# Altium schematic sheet PX4FLOW2.0_CPU_X0.SchDoc
size A4; DrawnBy: Philip Rowse
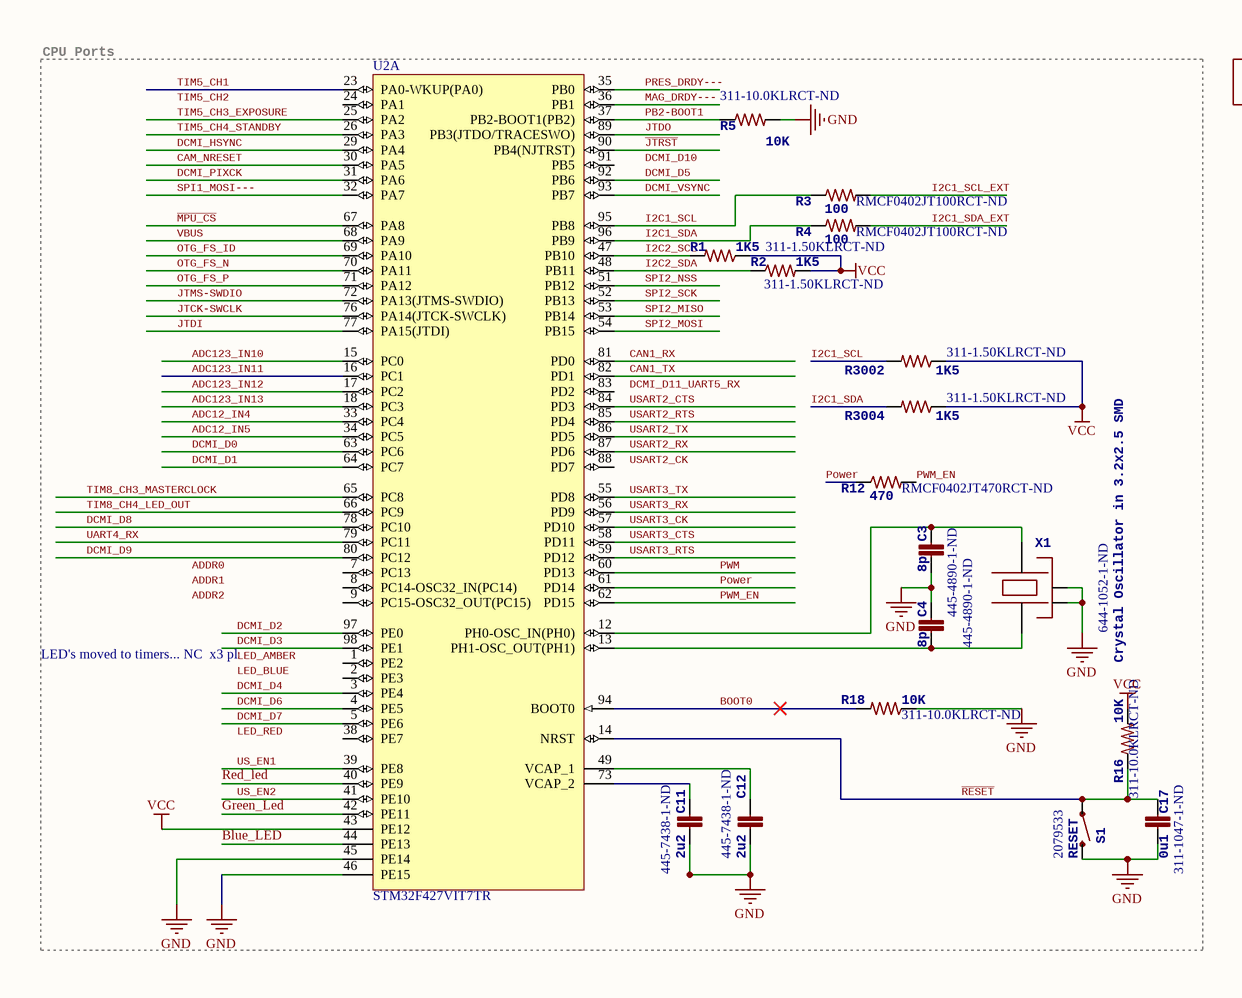
[diagram p0: PX4FLOW2.0_CPU_X0.SchDoc, left]
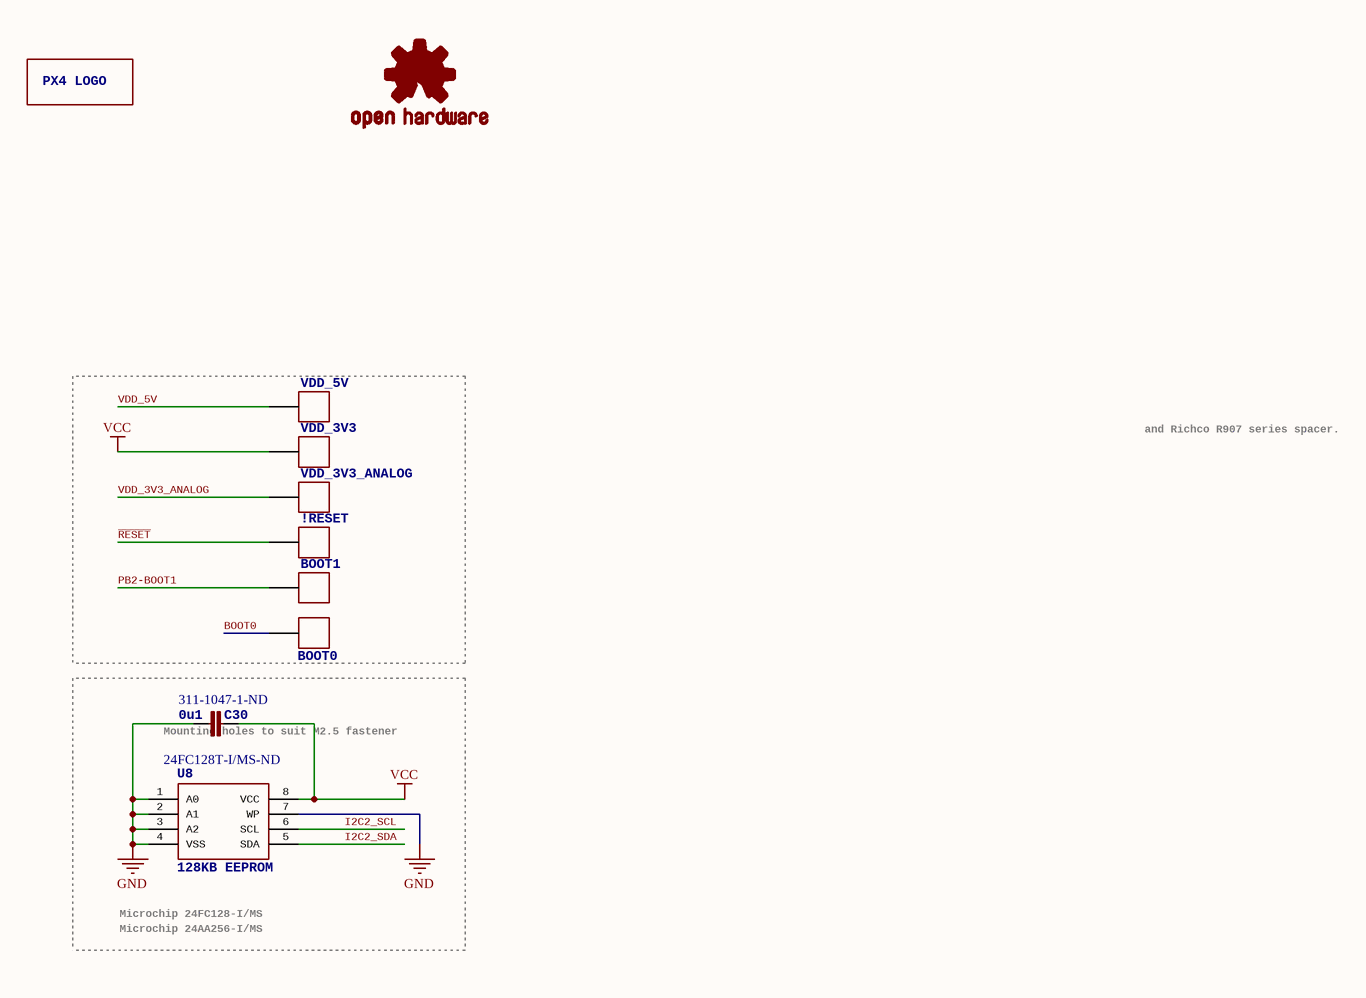
[diagram p1: PX4FLOW2.0_CPU_X0.SchDoc, right]

## Parts
!RESET  PAD.04  [PAD.04X.04]  (value not drawn)
BOOT0  PAD.05  [PAD.05X.05]  (value not drawn)
BOOT1  PAD.04  [PAD.04X.04]  (value not drawn)
C3  8p  Supplier Part Number 1: 445-4890-1-ND  [0402-CAP]
C4  8p  Supplier Part Number 1: 445-4890-1-ND  [0402-CAP]
C11  2u2  Supplier Part Number 1: 445-7438-1-ND  [0603-CAP]
C12  2u2  Supplier Part Number 1: 445-7438-1-ND  [0603-CAP]
C17  0u1  Supplier Part Number 1: 311-1047-1-ND  [0402-CAP]
C30  0u1  Supplier Part Number 1: 311-1047-1-ND  [0402-CAP]
R1  1K5  Supplier Part Number 1: 311-1.50KLRCT-ND  [R0402]
R2  1K5  Supplier Part Number 1: 311-1.50KLRCT-ND  [R0402]
R3  100  Supplier Part Number 1: RMCF0402JT100RCT-ND  [R0402]
R4  100  Supplier Part Number 1: RMCF0402JT100RCT-ND  [R0402]
R5  10K  Supplier Part Number 1: 311-10.0KLRCT-ND  [R0402]
R12  470  Supplier Part Number 1: RMCF0402JT470RCT-ND  [R0402]
R16  10K  Supplier Part Number 1: 311-10.0KLRCT-ND  [R0402]
R18  10K  Supplier Part Number 1: 311-10.0KLRCT-ND  [R0402]
R3002  1K5  Supplier Part Number 1: 311-1.50KLRCT-ND  [R0402]
R3004  1K5  Supplier Part Number 1: 311-1.50KLRCT-ND  [R0402]
S1  RESET  Supplier Part Number 1: 2079533  [EVQP7J01K]
U2  STM32F427VIT7TR  [STM-LQFP100_N]  (part A of 2)
U8  128KB EEPROM  Supplier Part Number 1: 24FC128T-I/MS-ND  [MSOP-8]
U$9  PX4LOGO: PX4 LOGO  [PX4-LOGO-20MM]  (hidden comment: PX4-LOGO-20MM)
U$10  OSHW-LOGOS  [OSHW-LOGO-S]  (value not drawn)
VDD_3V3  PAD.04  [PAD.04X.04]  (value not drawn)
VDD_3V3_ANALOG  PAD.04  [PAD.04X.04]  (value not drawn)
VDD_5V  PAD.04  [PAD.04X.04]  (value not drawn)
X1  Crystal Oscillator in 3.2x2.5 SMD  Supplier Part Number 1: 644-1052-1-ND  [OSCILLATOR-3.2X2.5]

## Nets
GND: C3.P$2 C4.P$1 C11.P$2 C12.P$2 C17.1 C30.2 R5.2 R18.1 S1.B3 U2.45(PE14) U2.46(PE15) U8.1(A0) U8.2(A1) U8.3(A2) U8.4(VSS) U8.7(WP) X1.2(NC_2) X1.4(NC_4)
VCC: C30.1 R1.1 R2.2 R16.2 R3002.1 R3004.1 U2.43(PE12) U8.8(VCC) VDD_3V3.P$1
ADC12_IN4: U2.33(PC4)
ADC12_IN5: U2.34(PC5)
ADC123_IN10: U2.15(PC0)
ADC123_IN11: U2.16(PC1)
ADC123_IN12: U2.17(PC2)
ADC123_IN13: U2.18(PC3)
Blue_LED: U2.44(PE13)
BOOT0: BOOT0.P$1 R18.2 U2.94(BOOT0)
CAM_NRESET: U2.30(PA5)
CAN1_RX: U2.81(PD0)
CAN1_TX: U2.82(PD1)
DCMI_D0: U2.63(PC6)
DCMI_D1: U2.64(PC7)
DCMI_D2: U2.97(PE0)
DCMI_D3: U2.98(PE1)
DCMI_D4: U2.3(PE4)
DCMI_D5: U2.92(PB6)
DCMI_D6: U2.4(PE5)
DCMI_D7: U2.5(PE6)
DCMI_D8: U2.78(PC10)
DCMI_D9: U2.80(PC12)
DCMI_HSYNC: U2.29(PA4)
DCMI_PIXCK: U2.31(PA6)
DCMI_VSYNC: U2.93(PB7)
Green_Led: U2.42(PE11)
I2C1_SCL: R3.1 R3002.2 U2.95(PB8)
I2C1_SCL_EXT: R3.2
I2C1_SDA: R4.1 R3004.2 U2.96(PB9)
I2C1_SDA_EXT: R4.2
I2C2_SCL: R1.2 U2.47(PB10) U8.6(SCL)
I2C2_SDA: R2.1 U2.48(PB11) U8.5(SDA)
~{JTRST}: U2.90(PB4(NJTRST))
JTCK-SWCLK: U2.76(PA14(JTCK-SWCLK))
JTDI: U2.77(PA15(JTDI))
JTDO: U2.89(PB3(JTDO/TRACESWO))
JTMS-SWDIO: U2.72(PA13(JTMS-SWDIO))
~{MPU_CS}: U2.67(PA8)
MAG_DRDY---: U2.36(PB1)
OTG_FS_ID: U2.69(PA10)
OTG_FS_N: U2.70(PA11)
OTG_FS_P: U2.71(PA12)
PB2-BOOT1: BOOT1.P$1 R5.1 U2.37(PB2-BOOT1(PB2))
Power: R12.1 U2.61(PD14)
PRES_DRDY---: U2.35(PB0)
PWM: U2.60(PD13)
PWM_EN: R12.2 U2.62(PD15)
~{RESET}: !RESET.P1 C17.2 R16.1 S1.A1 U2.14(NRST)
Red_led: U2.40(PE9)
SPI1_MOSI---: U2.32(PA7)
SPI2_MISO: U2.53(PB14)
SPI2_MOSI: U2.54(PB15)
SPI2_NSS: U2.51(PB12)
SPI2_SCK: U2.52(PB13)
TIM5_CH1: U2.23(PA0-WKUP(PA0))
TIM5_CH3_EXPOSURE: U2.25(PA2)
TIM5_CH4_STANDBY: U2.26(PA3)
TIM8_CH3_MASTERCLOCK: U2.65(PC8)
TIM8_CH4_LED_OUT: U2.66(PC9)
UART4_RX: U2.79(PC11)
US_EN1: U2.39(PE8)
US_EN2: U2.41(PE10)
USART2_CTS: U2.84(PD3)
USART2_RTS: U2.85(PD4)
USART2_RX: U2.87(PD6)
USART2_TX: U2.86(PD5)
USART3_CK: U2.57(PD10)
USART3_CTS: U2.58(PD11)
USART3_RTS: U2.59(PD12)
USART3_RX: U2.56(PD9)
USART3_TX: U2.55(PD8)
VBUS: U2.68(PA9)
VDD_3V3_ANALOG: VDD_3V3_ANALOG.P$1
VDD_5V: VDD_5V.P$1
NetC3_P$1: C3.P$1 U2.12(PH0-OSC_IN(PH0)) X1.3
NetC4_P$2: C4.P$2 U2.13(PH1-OSC_OUT(PH1)) X1.1
NetC11_P$1: C11.P$1 U2.73(VCAP_2)
NetC12_P$1: C12.P$1 U2.49(VCAP_1)

Not connected (* = marked no-connect by the designer): U2 1(PE2) 2(PE3) 7(PC13) 8(PC14-OSC32_IN(PC14)) 9(PC15-OSC32_OUT(PC15)) 24(PA1) 38(PE7) 83(PD2) 88(PD7) 91(PB5)

## Notes on the sheet
- CPU Ports
- and Richco R907 series spacer.
- LED's moved to timers... NC  x3 pl
- (near C30) Mounting holes to suit M2.5 fastener
- Microchip 24FC128-I/MS
- Microchip 24AA256-I/MS
- Labels drawn without touching a wire or pin: ADDR0, ADDR1, ADDR2, DCMI_D10, DCMI_D11_UART5_RX, LED_AMBER, LED_BLUE, LED_RED, TIM5_CH2, USART2_CK
- http://www.oshwa.org/
- http://creativecommons.org/licenses/by-sa/3.0/
- Title:
- Date:
- Time:
- Sheet:
- Approved:
- of:
- Drawn By:
- Checked By:
- 3DRobotics

## Library data of the parts
!RESET BOOT1 VDD_3V3 VDD_3V3_ANALOG VDD_5V = PAD.04: BOM: EXCLUDE; PARTNO: *
BOOT0 = PAD.05: Test pad This footprint includes three classes: The actual test pads, a pogo-pin footprint to mount the pogo-pin as through-hole part and a hole footprint which allows the head of the pogo-pin to pass through (do NOT use the hole to mount the pogo-pin). In a typical test setup, the stack would consist of three PCBs: The actual PCB under testing with a test pad on the bottom, then a second PCB with the hole for the pogo-pin head where the PCB under testing is pressed on and a third PCB at 30 mm / 1.2" distance with the pogo-pin footprints. The pogo-pins are soldered to the last PCB. To create the stack, copy the board under testing and exchange the footprints - this way the correct positioning is ensured.; BOM: EXCLUDE; PARTNO: *
C3 C4 = CAP0402: CAP CER 8PF 50V C0G 0402; PARTNO: C1005C0G1H080C; 3DR_PARTNO: ECM0710; Supplier 1: Digi-Key; Value: 8p
C11 C12 = CAP0603: Capacitor, 2.2uF, 16V, 10%, X6S, 0603, Ceramic; PARTNO: C1608X6S1C225K080AC; 3DR_PARTNO: ECM0619; Supplier 1: Digi-Key; Value: 2u2
C17 C30 = CAP0402-CAP: CapacitorStandard 0603 ceramic capacitor, and 0.1" leaded capacitor.; PARTNO: CC0402ZRY5V7BB104; Supplier 1: Digi-Key
R1 R2 R3002 R3004 = RESISTOR0402-RES: RES 1.5K OHM 1/16W 1% 0402 SMD; PARTNO: RC0402FR-071K5L; 3DR_PARTNO: ECM0803; Supplier 1: Digi-Key; Value: 1K5
R3 R4 R12 = RESISTOR0402-RES: ResistorBasic schematic elements and footprints for 0603, 1206, and PTH 1/10th watt (small) resistors.; PARTNO: RMCF0402JT100R; Supplier 1: Digi-Key
R5 R16 R18 = RESISTOR0402-RES: RES 10K OHM 1/16W 1% 0402 SMD; PARTNO: RC0402FR-0710KL; 3DR_PARTNO: ECM0800; Supplier 1: Digi-Key; Value: 10K
S1 = SWITCH-MOMENTARY-2: Switch; Supplier 1: Farnell
U2 = STM32F427VIT7TR: ARM Cortex-M4 32-bit MCU+FPU, 210 DMIPS, 2048 kB Flash, 256 kB Internal RAM, 82 I/Os, 100-pin LQFP, -40 to 105 degC, Tape and Reel; Manufacturer: STMicroelectronics; D/A Converter: 2x12-bit; FLASH Size (Prog) (kB): 2048; I/Os (High Current): 82; Internal RAM Size (kB): 256; Operating Frequency(F) (Processor speed) (MHz): 168; Supply Voltage(Vcc) max (V): 3.6; Supply Voltage(Vcc) min (V): 1.8; DatasheetVersion: Rev. 1; PackageVersion: Rev. 1, 06/2013; PackageReference: LQFP100; PackageDescription: 100-Pin Low Profile Quad Flat Package, 14 x 14 mm Body, 0.5 mm Pitch; Supplier 1: Newark; Supplier Part Number 1: 19X6230; Supplier 2: Mouser; Supplier Part Number 2: 511-STM32F427VIT7TR; Core: ARM Cortex-M4; Packing: Tape and Reel; Mounting Technology: Surface Mount; PartNumber: STM32F427VIT7TR; ComponentLink1Description: Manufacturer URL; ComponentLink1URL: http://www.st.com/web/en/home.html; ComponentLink2Description: Datasheet; ComponentLink2URL: http://www.st.com/st-web-ui/static/active/en/resource/technical/document/datasheet/DM00071990.pdf; ComponentLink3Description: Package Specification; ComponentLink3URL: http://www.st.com/st-web-ui/static/active/en/resource/technical/document/data_brief/DM00071938.pdf
U8 = EEPROM-I2CMSOP: I2C EEPROM Generic footprint for I2C EEPROMS. Compatible types include:    Microchip 24FC128-I/MS    Microchip 24AA256-I/MS    ST Microelectronics M24128-BWDW6TP; PARTNO: 24FC128-I/MS; Supplier 1: Digi-Key
U$9 = PX4-LOGO-20MM: BOM: EXCLUDE; PARTNO: *
U$10 = OSHW-LOGOS: Open Source Hardware Logo This logo indicates the piece of hardware it is found on incorporates a OSHW license and/or adheres to the definition of open source hardware found here: http://freedomdefined.org/OSHW; BOM: EXCLUDE; PARTNO: *
X1 = OSCILLATOR-3.2X2.5: CRYSTAL 24MHZ 8PF SMD; 3DR_PARTNO: ECM0708; PARTNO: NX3225SA-24.000MHZ-STD-CSR-1; Supplier 1: Digi-Key; Value: 24MHz